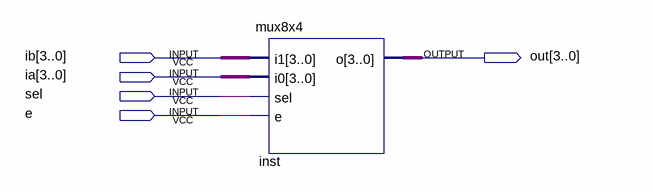
[diagram p0: schematic sheet]
// Quartus schematic Testemux8x4.bdf as structural Verilog: 1 symbols, 5 pins
module Testemux8x4 (
  input  [3:0] ib,
  input  [3:0] ia,
  input  sel,
  input  e,
  output [3:0] out
);

  mux8x4 inst (.i1(ib), .i0(ia), .sel(sel), .e(e), .o(out));
endmodule
